# Altium schematic sheet CircuitosCompensador.SchDoc
size A4
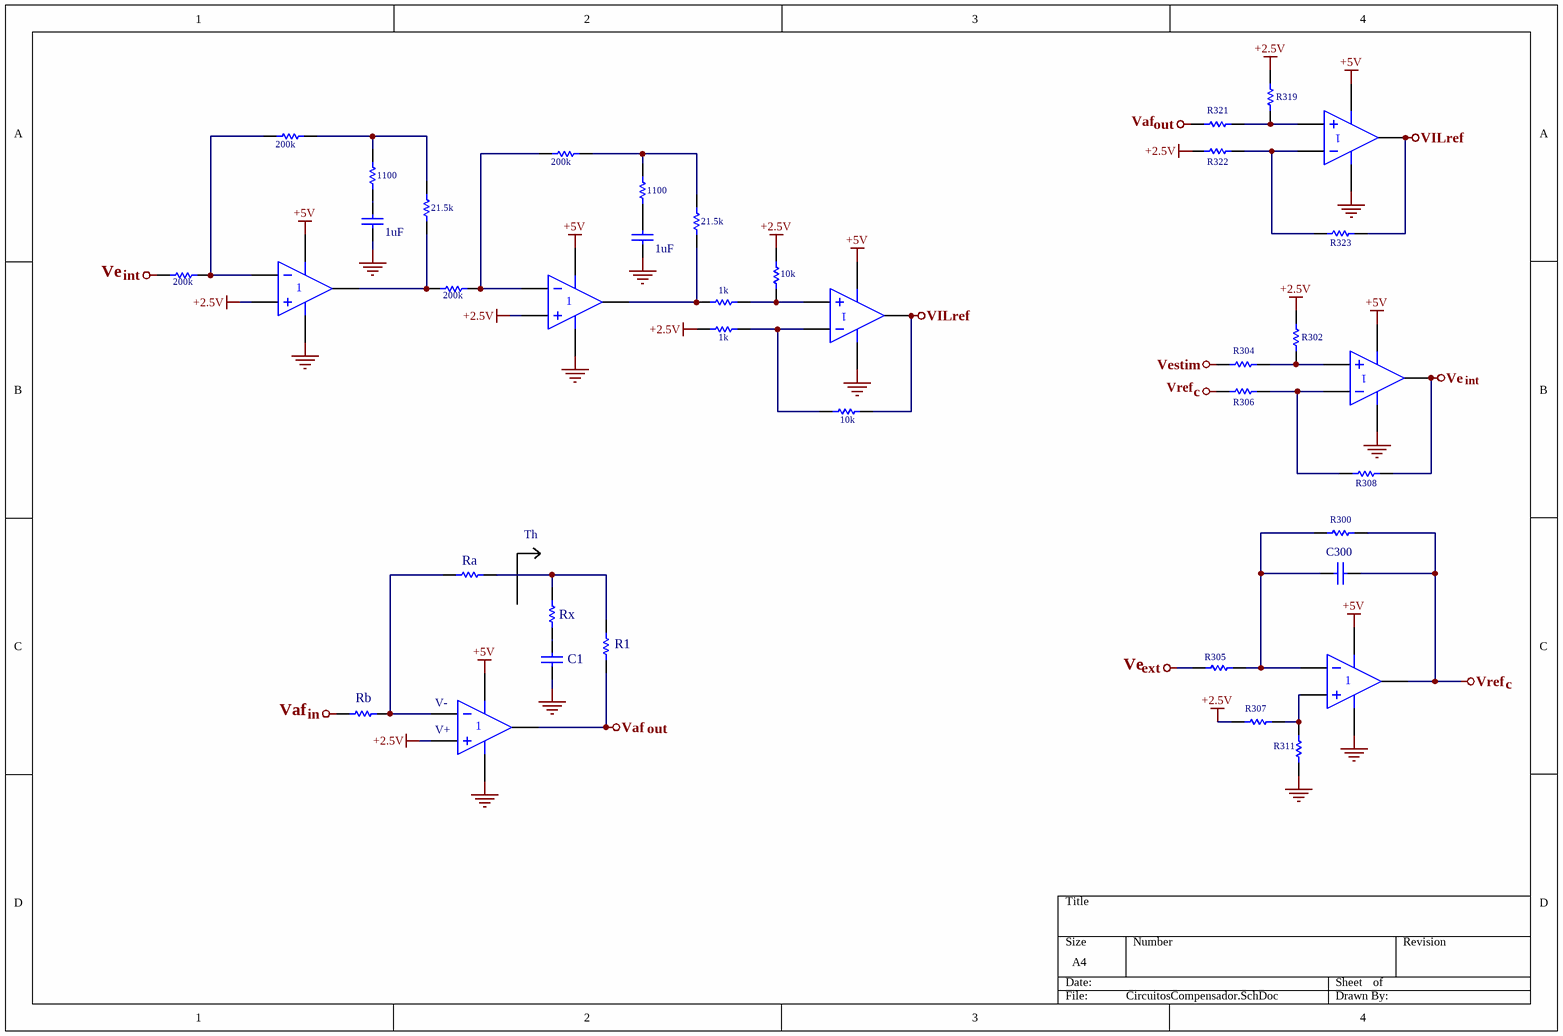
[diagram p0: CircuitosCompensador.SchDoc]

## Parts
C1  Capacitor  [C1206]  (value not drawn)
C24  value 1uF  [C1206]  (hidden comment: Capacitor)
C33  value 1uF  [C1206]  (hidden comment: Capacitor)
C300  Capacitor  [C1206]  (value not drawn)
R1  21.5k  [R1206]  (value not drawn)
R12  1100  [R1206]
R22  200k  [R1206]
R32  200k  [R1206]
R34  1100  [R1206]
R55  1k  [R1206]
R300  459K  [R1206]  (value not drawn)
R302  1k  [R1206]  (value not drawn)
R304  1k  [R1206]  (value not drawn)
R305  9.2k  [R1206]  (value not drawn)
R306  1k  [R1206]  (value not drawn)
R307  9.2k  [R1206]  (value not drawn)
R308  1k  [R1206]  (value not drawn)
R311  459k  [R1206]  (value not drawn)
R319  1k  [R1206]  (value not drawn)
R321  1k  [R1206]  (value not drawn)
R322  1k  [R1206]  (value not drawn)
R323  1k  [R1206]  (value not drawn)
R543  10k  [R1206]
R545  21.5k  [R1206]
R1222  21.5k  [R1206]
R6665  10k  [R1206]
R55533  1k  [R1206]
Ra  200k  [R1206]  (value not drawn)
Ras  200k  [R1206]
Rb  200k  [R1206]  (value not drawn)
Rdsd  200k  [R1206]
Rx  1100  [R1206]  (value not drawn)
U12  MCP664  [SOIC14]  (value not drawn)  (part A of 4)
U111  MCP664  [SOIC14]  (value not drawn)  (part A of 4)
U123  MCP664  [SOIC14]  (value not drawn)  (part A of 4)
U887  MCP664  [SOIC14]  (value not drawn)  (part A of 4)
U4334  MCP664  [SOIC14]  (value not drawn)  (part A of 4)
U?  MCP664  [SOIC14]  (value not drawn)  (part A of 4)
Urre  MCP664  [SOIC14]  (value not drawn)  (part A of 4)

## Nets
+2.5V: R55.1 R302.2 R307.1 R319.2 R543.2 U123.3(IN+) U4334.3(IN+) Urre.3(IN+)
+5V: U12.11(V-) U111.11(V-) U123.4(V+) U887.11(V-) U4334.4(V+) U?.4(V+) Urre.4(V+)
c: R306.1
ext: R305.1
GND: C1.1 C24.1 C33.1 R311.1 U12.4(V+) U111.4(V+) U123.11(V-) U887.4(V+) U4334.11(V-) U?.11(V-) Urre.11(V-)
in: Rb.1
int: Ras.1
out: R321.1
Vaf: R1.1 U123.1(OUT)
Ve: R308.2 U12.1(OUT)
Vestim: R304.1
VILref: R323.2 R6665.2 U111.1(OUT) U887.1(OUT)
Vref: C300.1 R300.2 U?.1(OUT)
NetC1_2: C1.2 Rx.1
NetC24_2: C24.2 R34.1
NetC33_2: C33.2 R12.1
NetC300_2: C300.2 R300.1 R305.2 U?.2(IN-)
NetR1_2: R1.2 Ra.2 Rx.2
NetR12_2: R12.2 R32.2 R545.2
NetR22_1: R22.1 Ras.2 U4334.2(IN-)
NetR22_2: R22.2 R34.2 R1222.2
NetR32_1: R32.1 Rdsd.2 Urre.2(IN-)
NetR55_2: R55.2 R6665.1 U887.2(IN-)
NetR302_1: R302.1 R304.2 U12.3(IN+)
NetR306_2: R306.2 R308.1 U12.2(IN-)
NetR307_2: R307.2 R311.2 U?.3(IN+)
NetR319_1: R319.1 R321.2 U111.3(IN+)
NetR322_2: R322.2 R323.1 U111.2(IN-)
NetR543_1: R543.1 R55533.2 U887.3(IN+)
NetR545_1: R545.1 R55533.1 Urre.1(OUT)
NetR1222_1: R1222.1 Rdsd.1 U4334.1(OUT)
NetRa_1: Ra.1 Rb.2 U123.2(IN-)

Not connected (* = marked no-connect by the designer): R322 1

## Notes on the sheet
- Th
- (near U123) V-
- (near U123) V+
- Labels drawn without touching a wire or pin: +2.5V, c, int, out, Vaf, Ve, Vref

## Library data of the parts
C1 C24 C33 = Capacitor: CAP CER 1UF 25V X7R 1206; Manufacturer: CAL-CHIP ELECTRONICS, INC.; Mfr PN: GMC31X7R105M25NT; Supllier 1: Digi-Key; Supplier 1 PN: 2571-GMC31X7R105M25NTTR-ND
  C1: Value: 1uF
C300 = Capacitor: CAP CER 22UF 16V X5R 1206; Manufacturer: Samsung Electro-Mechanics; Mfr PN: CL31A226MOCLNNC; Value: 22uF; Supplier 1 PN: 1276-2728-1-ND; Supplier 1: Digi-Key
R1 R545 R1222 = R1206: RES 21.5K OHM 1% 1/4W 1206; Manufacturer: YAGEO; Mfr PN: RC1206FR-0721K5L; PackageReference: 1206; Supplier 1: Digi-Key; Value: 21.5k; Tolerance: 1%; Supplier 1 PN: 311-21.5KFRCT-ND
R12 R34 Rx = R1206: RES 1.1K OHM 1% 1/4W 1206; Manufacturer: YAGEO; Mfr PN: RC1206FR-071K1L; PackageReference: 1206; Supplier 1: Digi-Key; Value: 1100; Tolerance: 1%; Supplier 1 PN: 311-1.10KFRCT-ND
R22 R32 Ra Ras Rb Rdsd = R1206: RES 200K OHM 1% 1/4W 1206; Manufacturer: YAGEO; Mfr PN: RC1206FR-07200KL; PackageReference: 1206; Supplier 1: Digi-Key; Value: 200k; Tolerance: 1%; Supplier 1 PN: 311-200KFRCT-ND
R55 R302 R306 R308 R319 R322 R323 R543 R6665 = R1206: RES 1K OHM 1% 1/4W 1206; Manufacturer: Stackpole Electronics Inc; Mfr PN: RMCF1206FT1K00; Supplier 1: Digi-Key; Value: 1k; Tolerance: 1%; Supplier 1 PN: RMCF1206FT1K00CT-ND
  R55 R306 R308 R322 R323 R6665: PackageReference: 1206
R300 R311 = R1206: RES 459K OHM 1% 1/4W 1206; Manufacturer: KOA Speer Electronics, Inc.; Mfr PN: RN73H2BTTD4593F10; PackageReference: 1206; Supplier 1: Digi-Key; Tolerance: 1%; Supplier 1 PN: 2019-RN73H2BTTD4593F10CT-ND
  R300: Value: 459K
  R311: Value: 459k
R304 R321 R55533 = R1206: RES 1K OHM 1% 1/4W 1206; Mfr PN: RMCF1206FT1K00; Manufacturer: Stackpole Electronics Inc; Supplier 1 PN: RMCF1206FT1K00CT-ND; Supplier 1: Digi-Key; Value: 1k; Tolerance: 1%
R305 R307 = R1206: RES 9.2K OHM 1% 1/4W 1206; Manufacturer: KOA Speer Electronics, Inc.; Mfr PN: RN73H2BTTD9201F10; PackageReference: 1206; Supplier 1: Digi-Key; Value: 9.2k; Tolerance: 1%; Supplier 1 PN: 2019-RN73H2BTTD9201F10CT-ND
U12 U111 U123 U887 U4334 U? Urre = MCP664: IC OPAMP GP 4 CIRCUIT 14TSSOP; Mfr PN: MCP664-E/ST; Manufacturer: Microchip Technology; Datasheet: https://ar.mouser.com/datasheet/2/268/20002194E-2448650.pdf; Supplier 1: Digi-Key; Supplier 1 PN: MCP664-E/ST-ND